# Altium schematic sheet switch_blk.SchDoc
size A4; Date: 1/11/16; Engineer: JBayalas; DocumentNumber: 12; Revision: V1.1; SheetNumber: 12; SheetTotal: 12
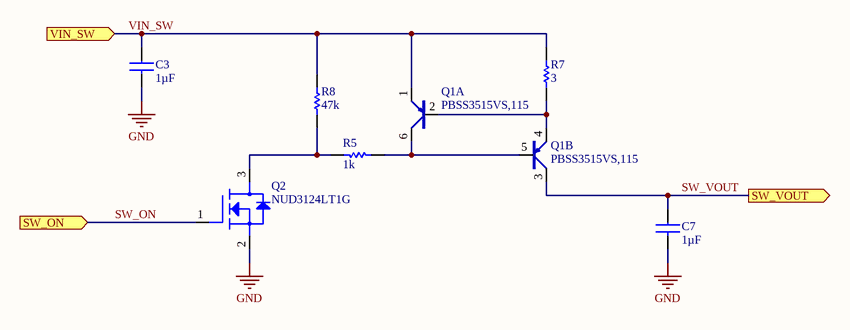
[diagram p0: switch_blk.SchDoc]

## Parts
C3  value 1µF  [C0603]  (hidden comment: EMK107B7105KA-T)
C7  value 1µF  [C0603]  (hidden comment: EMK107B7105KA-T)
Q1  PBSS3515VS,115  [SOT50P160X60-6N]  (parts A,B of 2)
Q2  NUD3124LT1G  [SOT-23-3]
R5  value 1k  [R0402]  (hidden comment: CRCW04021K00FKED)
R7  value 3  [R0402]  (hidden comment: RC0402FR-073RL)
R8  value 47k  [R0402]  (hidden comment: RC0402JR-0747KL)

## Ports
SW_ON (in), SW_VOUT (out), VIN_SW (in)

## Nets
GND: C3.2 C7.2 Q2.2(source)
SW_ON: Q2.1(gate) ; port SW_ON
SW_VOUT: C7.1 Q1.3(collector) ; port SW_VOUT
VIN_SW: C3.1 Q1.1(emitter) R7.2 R8.2 ; port VIN_SW
NetQ1_2: Q1.2(base) Q1.4(emitter) R7.1
NetQ1_5: Q1.5(base) Q1.6(collector) R5.2
NetQ2_3: Q2.3(drain) R5.1 R8.1

## Notes on the sheet
- Title:
- Sheet:
- Date:
- of
- Project:
- Revision:
- Engineer:
- Wi4B S.r.l

## Library data of the parts
C3 C7 = EMK107B7105KA-T: CAP CER 1UF 16V X7R 0603; MFT: Taiyo Yuden; TYPE: SMD; FUNCTION: Switch; MPN: EMK107B7105KA-T; RATING: 16V; LOAD: *
Q1 = PBSS3515VS,115: TRANS 2PNP 15V 0.5A SOT666; MFT: Nexperia USA Inc.; TYPE: SMD; FUNCTION: Switch; MPN: PBSS3515VS,115; LOAD: *; RATING: 15V; APN: *; VALUE: PBSS3515VS,115
Q2 = NUD3124LT1G: IC INDCT LOAD DRVR AUTO SOT23; MFT: ON Semiconductor; TYPE: Surface Mount; FUNCTION: Switch; VALUE: NUD3124LT1G; MPN: NUD3124LT1G
R5 = CRCW04021K00FKED: RES SMD 1K OHM 1% 1/16W 0402; MFT: Vishay Dale; RATING: 0.063W; APN: RQ-0013-R7-C; FUNCTION: Switch; MPN: CRCW04021K00FKED; TYPE: SMD
R7 = RC0402FR-073RL: RES 3 OHM 1% 1/16W 0402; MFT: YAGEO; FUNCTION: Switch; MPN: RC0402FR-073RL; TYPE: SMD; LOAD: *; RATING: 1/16W; APN: *
R8 = RC0402JR-0747KL: RES SMD 47K OHM 5% 1/16W 0402; MFT: Yageo; APN: RR-0473-R7-C; FUNCTION: Switch; MPN: RC0402JR-0747KL; LOAD: *; TYPE: SMD; RATING: 1/16W